# EAGLE design 4x4_hirose (EAGLE 7.2.0)
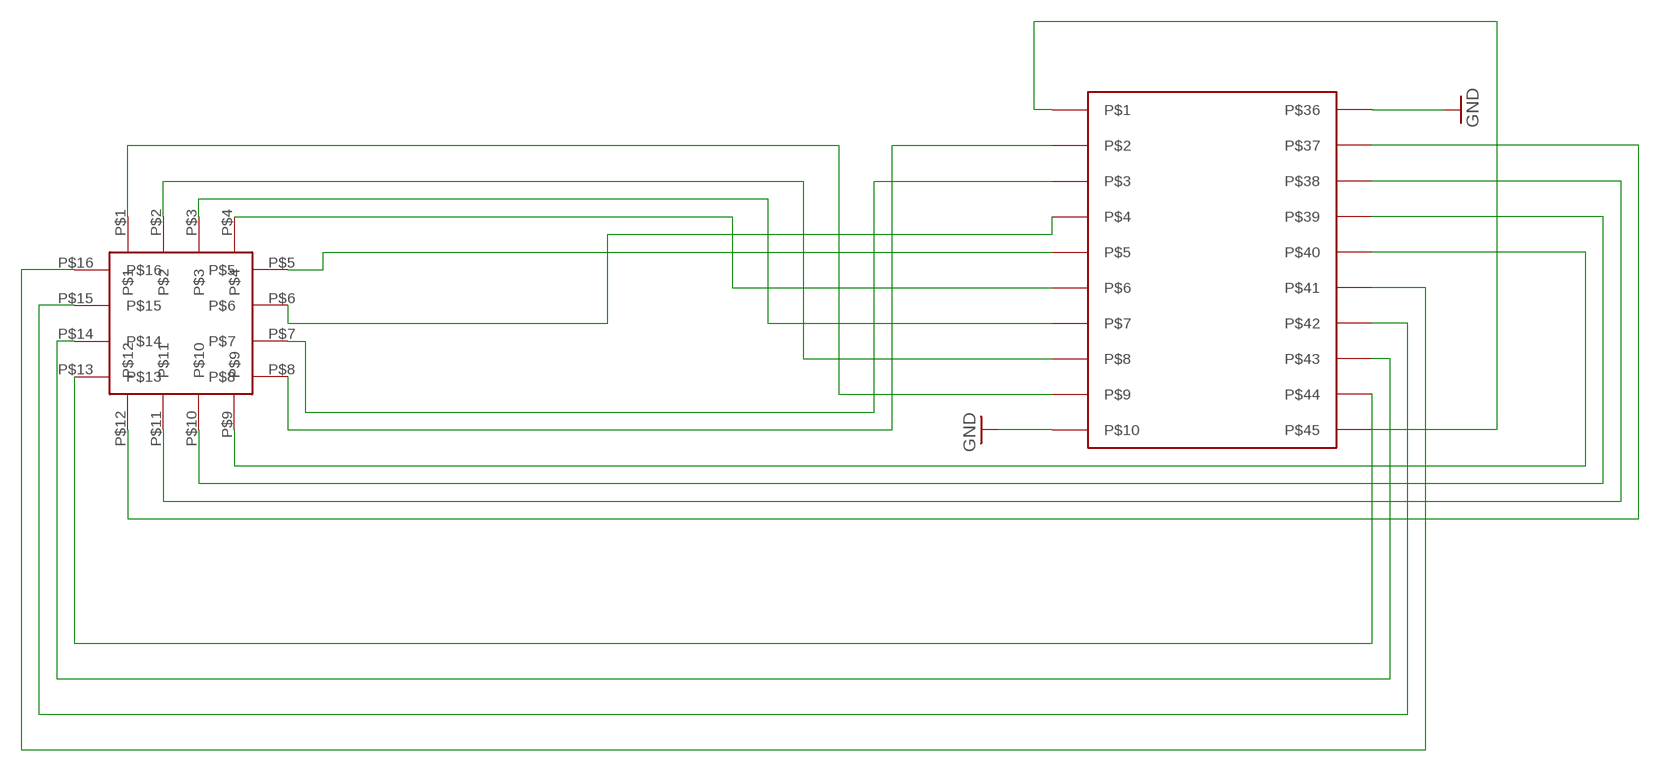
[diagram p0: schematic, sheet 1]

## Parts
U$1  GG_4X4_ARRAY  [GG_4X4_ARRAY]
U$3  HIROSE_DF40_70PIN  [HIROSE_DF40C-70DS]

## Nets
GND: U$3.P$10 U$3.P$36
N$1: U$1.P$4 U$3.P$6
N$20: U$1.P$1 U$3.P$9
N$30: U$1.P$2 U$3.P$8
N$40: U$1.P$3 U$3.P$7
N$60: U$1.P$5 U$3.P$5
N$70: U$1.P$6 U$3.P$4
N$80: U$1.P$7 U$3.P$3
N$90: U$1.P$8 U$3.P$2
N$100: U$1.P$9 U$3.P$40
N$110: U$1.P$10 U$3.P$39
N$120: U$1.P$11 U$3.P$38
N$130: U$1.P$12 U$3.P$37
N$140: U$1.P$13 U$3.P$44
N$150: U$1.P$14 U$3.P$43
N$160: U$1.P$15 U$3.P$42
N$170: U$1.P$16 U$3.P$41
REF: U$3.P$1 U$3.P$45

## Library data of the parts
U$1 = GG_4x4_3mildrill_20milspacing:GG_4X4_ARRAY
U$3 = GG_hirose20:HIROSE_DF40_70PIN

## Board
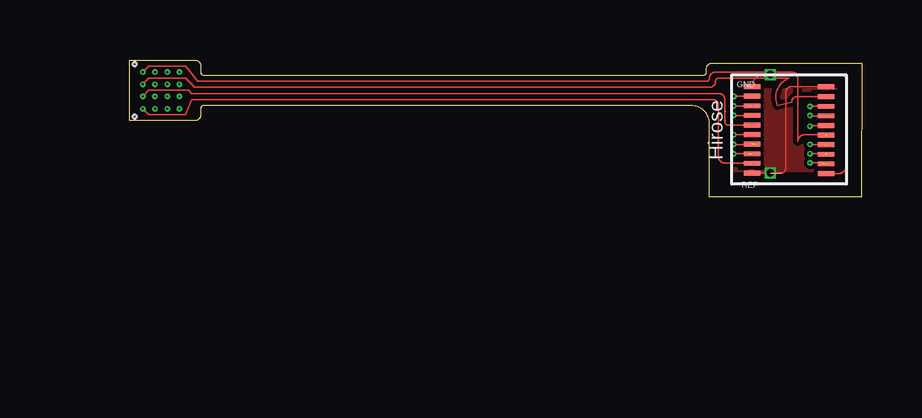
[diagram p1: board, top side]
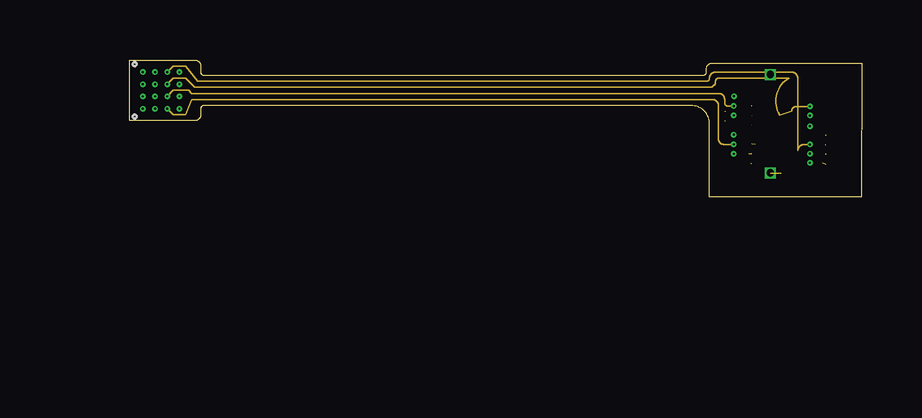
[diagram p2: board, inner layer Route2]
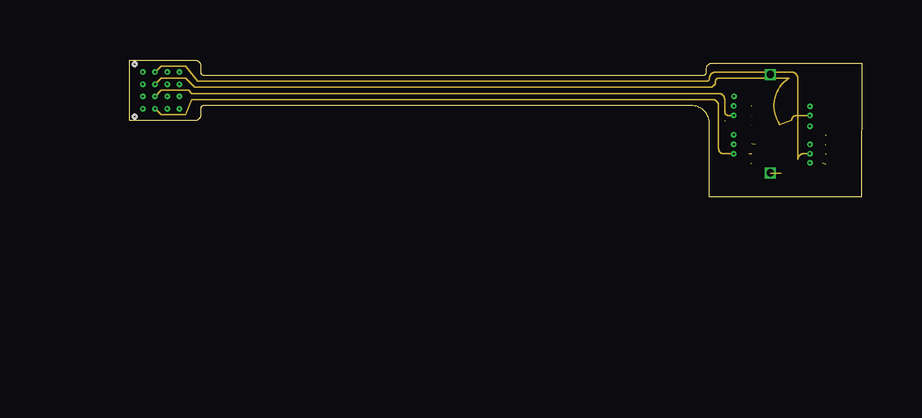
[diagram p3: board, inner layer Route15]
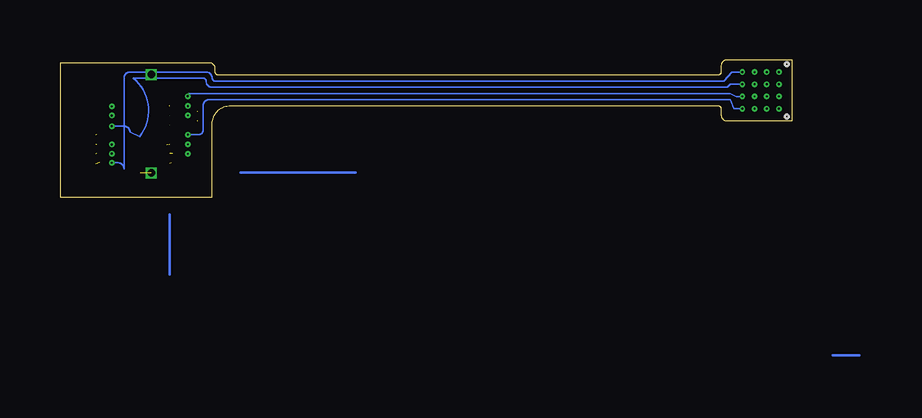
[diagram p4: board, bottom side, seen from below]

Size 30.53 x 5.71 mm. Coordinates in mm from the lower left corner, seen from the top.
Outline: 0,5.71 2.71,5.71 arc-90 2.97,5.46 2.97,5.21 arc90 3.09,5.08 23.92,5.08 arc90 24.05,5.21 24.05,5.33 arc-90 24.3,5.59 30.53,5.59 30.51,0 24.18,0 24.18,3.05 arc90 23.41,3.81 3.09,3.81 arc90 2.97,3.68 2.97,3.43 arc-90 2.71,3.18 0,3.18 0,5.71
Copper layers (1*2*15*16): Top 0.035mm / dielectric 1.5mm / Route2 0.035mm / dielectric 0.15mm / Route15 0.035mm / dielectric 0.2mm / Bottom 0.035mm
Design rules "default *": minimum track width 3mil, minimum drill 0.1mm, track to track 0.15mm, track to pad 0.15mm, pad to pad 0.15mm, via to via 0.15mm, smd to smd 0.15mm, copper to edge 40mil, drill to drill 0.05mm, minimum pad ring 3mil, minimum via ring 3mil, stop-mask expansion 4mil, vias tented up to drill 0mil, thermal gap 10mil
Holes 0.15 mm at 0.21,3.34 0.21,5.55

### Footprints (pad centres in the part's own frame; a part is rotated, then mirrored left to right if it is on the bottom)
GG_4X4_ARRAY = drill 0.076 pad 0.178: P$1 0,0; P$2 0.508,0; P$3 1.016,0; P$4 1.524,0; P$5 0,-0.508; P$6 0.508,-0.508; P$7 1.016,-0.508; P$8 1.524,-0.508; P$9 0,-1.016; P$10 0.508,-1.016; P$11 1.016,-1.016; P$12 1.524,-1.016; P$13 0,-1.524; P$14 0.508,-1.524; P$15 1.016,-1.524; P$16 1.524,-1.524
HIROSE_DF40C-70DS = smd 0.2 x 0.7: P$1 0,0; P$2 -0.4,0; P$3 -0.8,0; P$4 -1.2,0; P$5 -1.6,0; P$6 -2,0; P$7 -2.4,0; P$8 -2.8,0; P$9 -3.2,0; P$10 -3.6,0; P$36 0,-3.08; P$37 -0.42,-3.08; P$38 -0.82,-3.08; P$39 -1.22,-3.08; P$40 -1.62,-3.08; P$41 -2.02,-3.08; P$42 -2.42,-3.08; P$43 -2.82,-3.08; P$44 -3.22,-3.08; P$45 -3.62,-3.08

### Placement (x,y rotation side)
U$1  0.55,3.68 180 bottom
U$3  25.95,4.6 90 top

### Tracks (layer width: path | path; a pad name or v marks a point on that pad's centre or on a via)
GND  (via drill 0.3)  (1 unrouted)
  Top 0.07: U$3.P$10 27.18,1 arc90 27.35,1.17 27.35,4.35 arc-90 27.61,4.6 U$3.P$36
  other vias: 26.72,1
  pour Top: 24.18,0 30.53,0 30.53,5.33 24.18,5.33
N$1  (via drill 0.08)
  Top 0.07: U$3.P$6 v25.19,2.6
  Bottom 0.07: U$1.P$4 2.43,3.68 2.59,4.06 24.3,4.06 arc-90 24.56,3.81 24.56,2.79 arc90 24.75,2.6 v25.19,2.6
N$20  (1 unrouted)
  Top 0.07: U$1.P$1 0.81,3.43 2.33,3.43 2.59,4.06 24.3,4.06 arc-90 24.56,3.81 24.56,1.65 arc90 24.81,1.42 25.89,1.42
N$30  (via drill 0.08)  (1 unrouted)
  Top 0.07: v25.19,1.8 25.83,1.8
  Route15 0.07: U$1.P$2 1.32,3.43 2.33,3.43 2.59,4.06 24.3,4.06 arc-90 24.56,3.81 24.56,2.03 arc90 24.77,1.8 v25.19,1.8
N$40  (via drill 0.08)  (1 unrouted)
  Top 0.07: v25.19,2.19 26.08,2.19
  Route2 0.07: U$1.P$3 1.82,3.43 2.33,3.43 2.59,4.06 24.3,4.06 arc-90 24.56,3.81 24.56,2.41 arc90 24.75,2.19 v25.19,2.19
N$60  (2 unrouted)
  Top 0.07: U$1.P$5 0.81,4.45 2.46,4.45 2.59,4.32 24.56,4.32 arc-90 24.81,4.06 24.81,3.18 | U$3.P$5 24.96,2.99 arc-90 24.81,3.16
N$70  (via drill 0.08)  (2 unrouted)
  Top 0.07: U$3.P$4 v25.19,3.4
  Route15 0.07: U$1.P$6 1.32,4.45 2.46,4.45 2.59,4.32 24.56,4.32 arc-90 24.81,4.06 24.81,3.58 | v25.19,3.4 24.96,3.4 arc-90 24.81,3.56
N$80  (via drill 0.08)  (1 unrouted)
  Top 0.07: U$3.P$3 v25.19,3.79
  Route2 0.07: U$1.P$7 1.82,4.45 2.46,4.45 2.59,4.32 24.56,4.32 arc-90 24.81,4.06 24.81,3.94 arc90 24.93,3.79 v25.19,3.79
N$90  (via drill 0.08)
  Top 0.07: U$3.P$2 v25.2,4.2
  Bottom 0.07: U$1.P$8 2.33,4.19 2.59,4.32 25.08,4.32 arc-90 v25.2,4.2
N$100  (via drill 0.08)  (1 unrouted)
  Top 0.07: U$1.P$9 0.81,4.95 2.33,4.95 2.71,4.57 24.18,4.57 arc90 24.43,4.83 arc-90 24.56,4.95 27.48,4.95 | U$3.P$40 28.4,2.98 arc90 v28.37,2.95
  Bottom 0.07: v28.37,2.95 27.86,2.95 arc90 27.61,2.7 27.2,2.52 arc-90 27.48,4.95
N$110  (via drill 0.08)
  Top 0.07: U$3.P$39 28.38,3.38 arc-90 v28.37,3.39
  Route15 0.07: U$1.P$10 1.32,4.95 2.33,4.95 2.71,4.57 24.18,4.57 arc90 24.43,4.83 arc-90 24.56,4.95 27.48,4.95 arc90 27.11,3.02 27.61,3.2 arc-90 27.8,3.39 v28.37,3.39
N$120  (via drill 0.08)
  Top 0.07: U$3.P$38 v28.37,3.78 arc90 v28.37,3.77
  Route2 0.07: U$1.P$11 1.82,4.95 2.33,4.95 2.71,4.57 24.18,4.57 arc90 24.43,4.83 arc-90 24.56,4.95 27.48,4.95 arc90 27.11,3.42 27.61,3.58 arc-90 27.8,3.77 v28.37,3.77
N$130  (1 unrouted)
  Top 0.07: U$3.P$37 27.82,4.18 arc90 27.61,3.96 27,3.82 arc-90 27.48,4.95
  Bottom 0.07: U$1.P$12 2.59,4.7 2.71,4.57 24.18,4.57 arc90 24.43,4.83 arc-90 24.56,4.95 27.48,4.95
N$140  (via drill 0.08)  (2 unrouted)
  Top 0.07: U$1.P$13 0.81,5.46 2.33,5.46 2.84,4.83 24.05,4.83 arc90 24.18,4.95 arc-90 24.43,5.21 27.61,5.21 arc-90 27.86,4.95 | v28.37,1.43 28.88,1.43
  Bottom 0.07: v28.37,1.43 28.11,1.43 arc90 27.86,1.17 27.86,4.95
N$150  (via drill 0.08)  (1 unrouted)
  Top 0.07: v28.37,1.81 29,1.81
  Route15 0.07: U$1.P$14 1.32,5.46 2.33,5.46 2.84,4.83 24.05,4.83 arc90 24.18,4.95 arc-90 24.43,5.21 27.61,5.21 arc-90 27.86,4.95 27.86,1.55 arc-90 28.11,1.81 v28.37,1.81
N$160  (via drill 0.08)  (1 unrouted)
  Top 0.07: v28.37,2.19 29,2.19
  Route2 0.07: U$1.P$15 1.82,5.46 2.33,5.46 2.84,4.83 24.05,4.83 arc90 24.18,4.95 arc-90 24.43,5.21 27.61,5.21 arc-90 27.86,4.95 27.86,1.93 arc-90 28.11,2.19 v28.37,2.19
N$170  (2 unrouted)
  Top 0.07: 29,2.59 28.14,2.59 arc90 27.86,2.31 27.86,4.95
  Bottom 0.07: U$1.P$16 2.52,5.21 2.84,4.83 24.05,4.83 arc90 24.18,4.95 arc-90 24.43,5.21 27.61,5.21 arc-90 27.86,4.95
REF  (via drill 0.3)
  Top 0.07: U$3.P$45 29.57,0.98 arc90 29.89,1.3 29.89,4.85 arc90 29.64,5.11 v26.72,5.11 26.46,5.11 arc90 U$3.P$1
S$1
  Bottom 0.1: -2.8,-6.61 -1.7,-6.61
S$2
  Bottom 0.1: 25.95,-0.74 25.95,-3.24
S$3
  Bottom 0.1: 23,1.02 18.2,1.02

### Text on the board
tNames: GND | REF